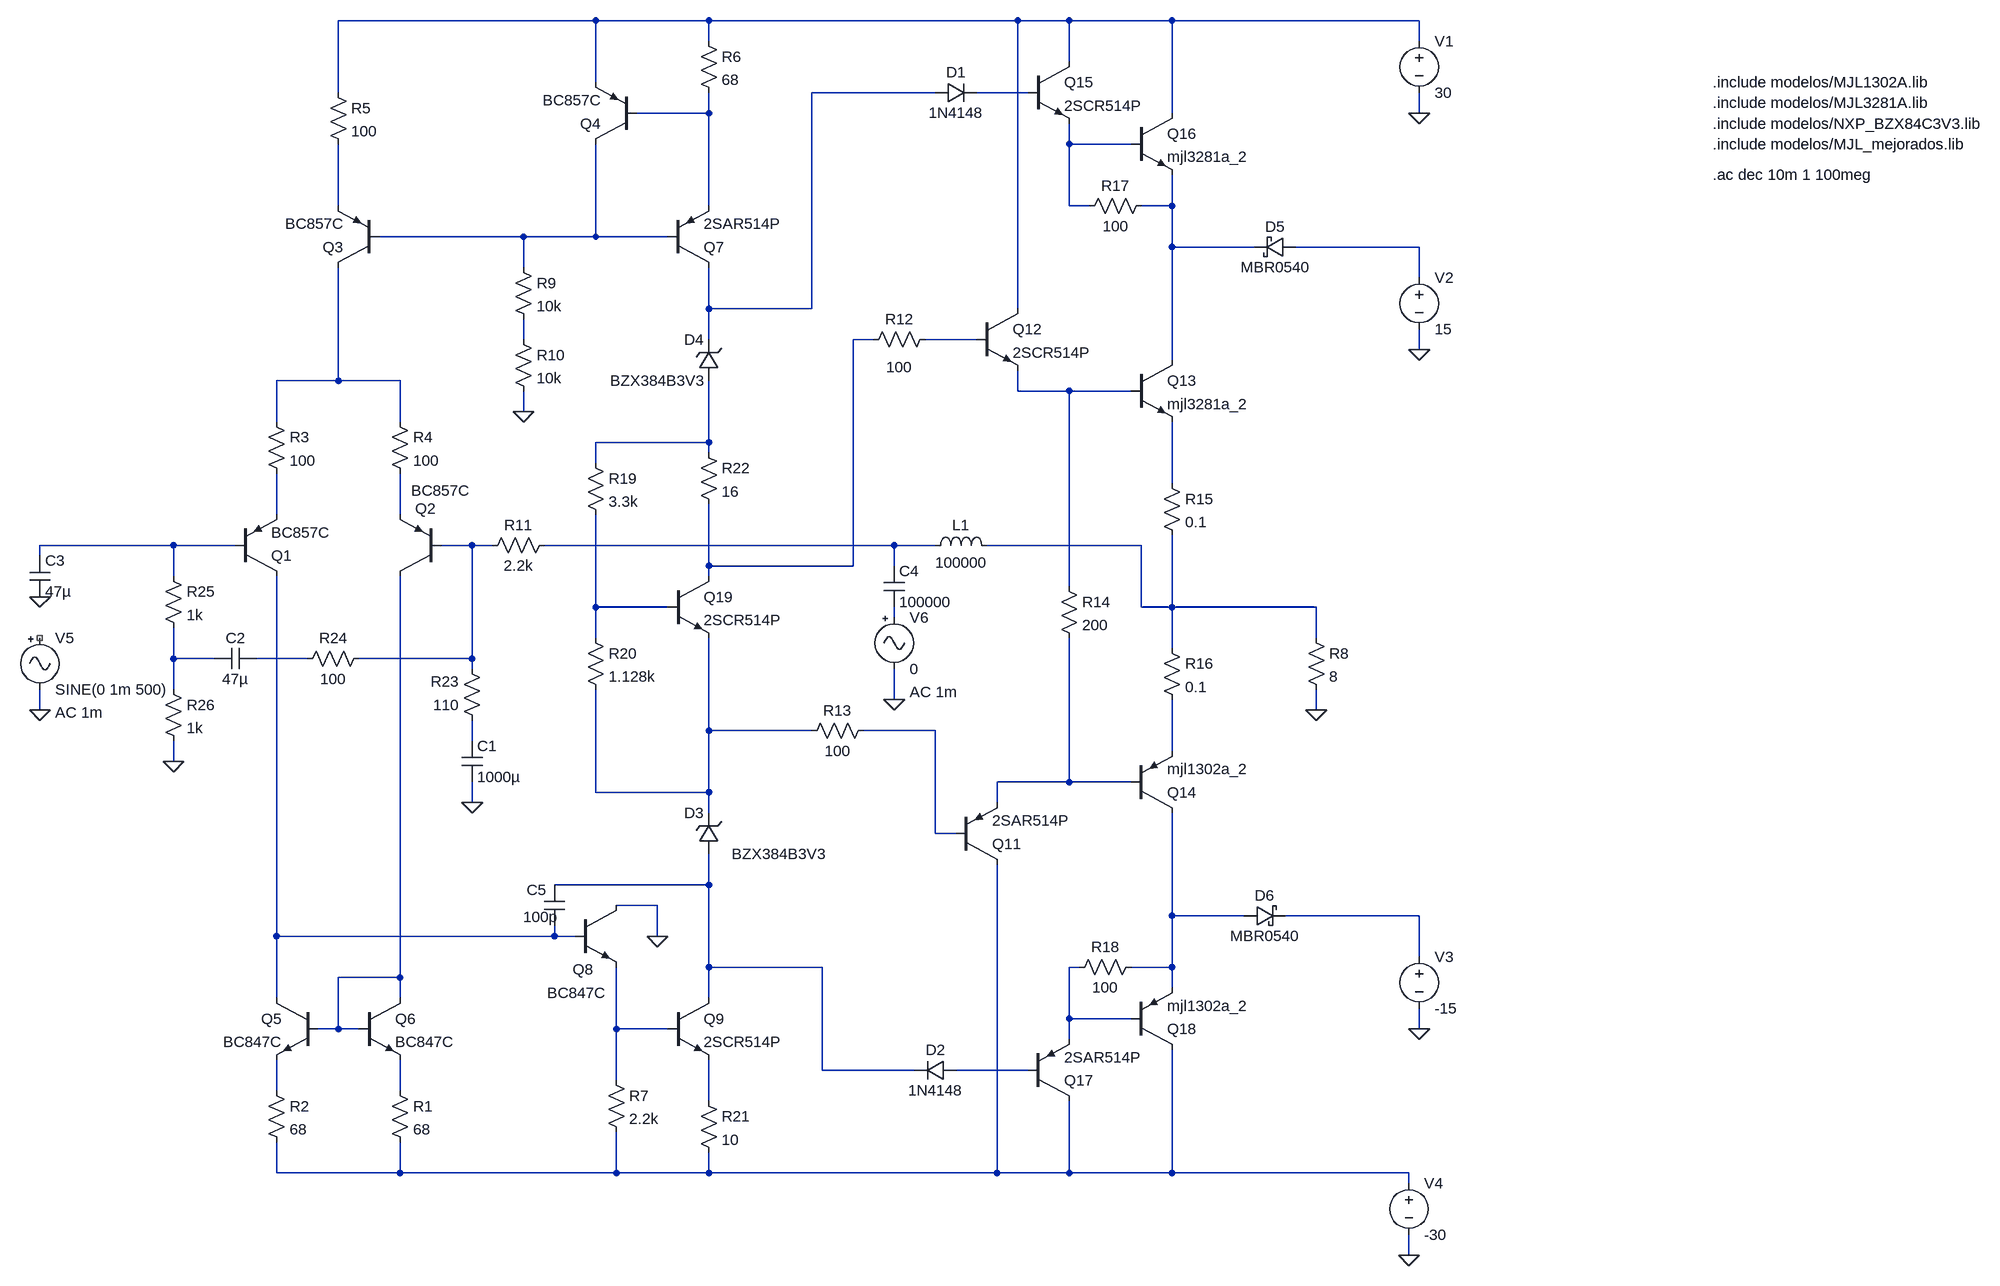
[diagram p0: schematic tp_final_amplificador_lazo_abierto.asc]
tp_final_amplificador_lazo_abierto.asc, the LTspice schematic file:
Version 4
SHEET 1 2220 1048
WIRE 48 -912 -352 -912
WIRE 224 -912 48 -912
WIRE 704 -912 224 -912
WIRE 784 -912 704 -912
WIRE 944 -912 784 -912
WIRE 1328 -912 944 -912
WIRE 224 -880 224 -912
WIRE 1328 -880 1328 -912
WIRE 784 -848 784 -912
WIRE 48 -816 48 -912
WIRE -352 -800 -352 -912
WIRE 576 -800 384 -800
WIRE 720 -800 640 -800
WIRE 224 -768 224 -800
WIRE 224 -768 112 -768
WIRE 944 -768 944 -912
WIRE 1328 -768 1328 -800
WIRE 784 -720 784 -752
WIRE 880 -720 784 -720
WIRE -352 -624 -352 -720
WIRE 224 -624 224 -768
WIRE 784 -624 784 -720
WIRE 816 -624 784 -624
WIRE 944 -624 944 -672
WIRE 944 -624 896 -624
WIRE -64 -576 -288 -576
WIRE 48 -576 48 -720
WIRE 48 -576 -64 -576
WIRE 160 -576 48 -576
WIRE 944 -560 944 -624
WIRE 1072 -560 944 -560
WIRE 1328 -560 1136 -560
WIRE -64 -528 -64 -576
WIRE 1328 -512 1328 -560
WIRE 224 -464 224 -528
WIRE 384 -464 384 -800
WIRE 384 -464 224 -464
WIRE 704 -464 704 -912
WIRE -64 -416 -64 -448
WIRE 224 -416 224 -464
WIRE 480 -416 448 -416
WIRE 640 -416 560 -416
WIRE 1328 -400 1328 -432
WIRE 944 -384 944 -560
WIRE -352 -352 -352 -528
WIRE -352 -352 -448 -352
WIRE -256 -352 -352 -352
WIRE 704 -336 704 -368
WIRE 784 -336 704 -336
WIRE 880 -336 784 -336
WIRE -64 -304 -64 -336
WIRE -448 -288 -448 -352
WIRE -256 -288 -256 -352
WIRE 224 -256 224 -352
WIRE 224 -256 48 -256
WIRE 224 -240 224 -256
WIRE 48 -224 48 -256
WIRE 944 -192 944 -288
WIRE -448 -144 -448 -208
WIRE -256 -144 -256 -208
WIRE -608 -96 -816 -96
WIRE -512 -96 -608 -96
WIRE -144 -96 -192 -96
WIRE -112 -96 -144 -96
WIRE 512 -96 -32 -96
WIRE 576 -96 512 -96
WIRE 896 -96 656 -96
WIRE -816 -80 -816 -96
WIRE 224 -64 224 -160
WIRE 448 -64 448 -416
WIRE 448 -64 224 -64
WIRE 512 -64 512 -96
WIRE -608 -48 -608 -96
WIRE 224 -48 224 -64
WIRE 784 -32 784 -336
WIRE 48 0 48 -144
WIRE 160 0 48 0
WIRE 896 0 896 -96
WIRE 944 0 944 -112
WIRE 944 0 896 0
WIRE 1168 0 944 0
WIRE 512 16 512 0
WIRE 48 48 48 0
WIRE 1168 48 1168 0
WIRE 944 64 944 0
WIRE -608 80 -608 32
WIRE -544 80 -608 80
WIRE -400 80 -480 80
WIRE -144 80 -144 -96
WIRE -144 80 -320 80
WIRE -144 96 -144 80
WIRE -608 128 -608 80
WIRE 512 144 512 96
WIRE -816 160 -816 128
WIRE 1168 160 1168 128
WIRE 224 192 224 48
WIRE 384 192 224 192
WIRE 576 192 464 192
WIRE -144 208 -144 176
WIRE 944 224 944 144
WIRE -608 240 -608 208
WIRE 784 272 784 48
WIRE 784 272 672 272
WIRE 880 272 784 272
WIRE 48 288 48 128
WIRE 224 288 224 192
WIRE 224 288 48 288
WIRE -144 304 -144 272
WIRE 672 304 672 272
WIRE 224 320 224 288
WIRE 576 352 576 192
WIRE 608 352 576 352
WIRE 224 432 224 384
WIRE 224 432 -16 432
WIRE 144 464 80 464
WIRE 944 480 944 320
WIRE 1056 480 944 480
WIRE 1328 480 1120 480
WIRE -448 512 -448 -48
WIRE -16 512 -16 496
WIRE -16 512 -448 512
WIRE 16 512 -16 512
WIRE 144 512 144 464
WIRE 1328 544 1328 480
WIRE 224 560 224 432
WIRE 400 560 224 560
WIRE 800 560 784 560
WIRE 944 560 944 480
WIRE 944 560 880 560
WIRE -256 576 -256 -48
WIRE -256 576 -352 576
WIRE 944 592 944 560
WIRE -448 608 -448 512
WIRE -256 608 -256 576
WIRE 224 608 224 560
WIRE 784 640 784 560
WIRE 880 640 784 640
WIRE -352 656 -352 576
WIRE -352 656 -384 656
WIRE -320 656 -352 656
WIRE 80 656 80 560
WIRE 160 656 80 656
WIRE 1328 656 1328 624
WIRE 784 672 784 640
WIRE 400 720 400 560
WIRE 544 720 400 720
WIRE 720 720 608 720
WIRE 80 736 80 656
WIRE -448 752 -448 704
WIRE -256 752 -256 704
WIRE 224 768 224 704
WIRE -448 880 -448 832
WIRE -256 880 -256 832
WIRE -256 880 -448 880
WIRE 80 880 80 816
WIRE 80 880 -256 880
WIRE 224 880 224 848
WIRE 224 880 80 880
WIRE 672 880 672 400
WIRE 672 880 224 880
WIRE 784 880 784 768
WIRE 784 880 672 880
WIRE 944 880 944 688
WIRE 944 880 784 880
WIRE 1312 880 944 880
WIRE 1312 896 1312 880
WIRE 1312 1008 1312 976
FLAG 144 512 0
FLAG 1168 160 0
FLAG 1312 1008 0
FLAG 1328 656 0
FLAG 1328 -400 0
FLAG 1328 -768 0
FLAG -64 -304 0
FLAG -144 304 0
FLAG -608 240 0
FLAG -816 160 0
FLAG 512 144 0
FLAG -816 -16 0
SYMBOL pnp -512 -48 M180
SYMATTR InstName Q1
SYMATTR Value BC857C
SYMBOL pnp -192 -48 R180
WINDOW 0 8 105 Left 2
WINDOW 3 -44 133 Left 2
SYMATTR InstName Q2
SYMATTR Value BC857C
SYMBOL pnp -288 -528 R180
SYMATTR InstName Q3
SYMATTR Value BC857C
SYMBOL pnp 112 -720 R180
SYMATTR InstName Q4
SYMATTR Value BC857C
SYMBOL npn -384 608 M0
SYMATTR InstName Q5
SYMATTR Value BC847C
SYMBOL npn -320 608 R0
SYMATTR InstName Q6
SYMATTR Value BC847C
SYMBOL res -272 736 R0
SYMATTR InstName R1
SYMATTR Value 68
SYMBOL res -464 736 R0
SYMATTR InstName R2
SYMATTR Value 68
SYMBOL res -464 -304 R0
SYMATTR InstName R3
SYMATTR Value 100
SYMBOL res -272 -304 R0
SYMATTR InstName R4
SYMATTR Value 100
SYMBOL res -368 -816 R0
SYMATTR InstName R5
SYMATTR Value 100
SYMBOL res 208 -896 R0
SYMATTR InstName R6
SYMATTR Value 68
SYMBOL pnp 160 -528 M180
SYMATTR InstName Q7
SYMATTR Value 2SAR514P
SYMBOL npn 16 464 R0
WINDOW 0 -4 99 Left 2
WINDOW 3 -43 136 Left 2
SYMATTR InstName Q8
SYMATTR Value BC847C
SYMBOL npn 160 608 R0
SYMATTR InstName Q9
SYMATTR Value 2SCR514P
SYMBOL res 64 720 R0
SYMATTR InstName R7
SYMATTR Value 2.2k
SYMBOL res 576 -432 R90
WINDOW 0 0 56 VBottom 2
WINDOW 3 43 56 VTop 2
SYMATTR InstName R12
SYMATTR Value 100
SYMBOL res 480 176 R90
WINDOW 0 0 56 VBottom 2
WINDOW 3 32 56 VTop 2
SYMATTR InstName R13
SYMATTR Value 100
SYMBOL npn 640 -464 R0
SYMATTR InstName Q12
SYMATTR Value 2SCR514P
SYMBOL npn 880 -384 R0
SYMATTR InstName Q13
SYMATTR Value mjl3281a_2
SYMBOL pnp 608 400 M180
SYMATTR InstName Q11
SYMATTR Value 2SAR514P
SYMBOL pnp 880 320 M180
SYMATTR InstName Q14
SYMATTR Value mjl1302a_2
SYMBOL res 768 -48 R0
SYMATTR InstName R14
SYMATTR Value 200
SYMBOL res 928 -208 R0
SYMATTR InstName R15
SYMATTR Value 0.1
SYMBOL res 928 48 R0
SYMATTR InstName R16
SYMATTR Value 0.1
SYMBOL npn 720 -848 R0
SYMATTR InstName Q15
SYMATTR Value 2SCR514P
SYMBOL npn 880 -768 R0
SYMATTR InstName Q16
SYMATTR Value mjl3281a_2
SYMBOL res 912 -640 R90
WINDOW 0 0 56 VBottom 2
WINDOW 3 32 56 VTop 2
SYMATTR InstName R17
SYMATTR Value 100
SYMBOL diode 576 -784 R270
WINDOW 0 32 32 VTop 2
WINDOW 3 0 32 VBottom 2
SYMATTR InstName D1
SYMATTR Value 1N4148
SYMBOL diode 608 704 R90
WINDOW 0 0 32 VBottom 2
WINDOW 3 32 32 VTop 2
SYMATTR InstName D2
SYMATTR Value 1N4148
SYMBOL pnp 720 768 M180
SYMATTR InstName Q17
SYMATTR Value 2SAR514P
SYMBOL pnp 880 688 M180
SYMATTR InstName Q18
SYMATTR Value mjl1302a_2
SYMBOL res 896 544 R90
WINDOW 0 0 56 VBottom 2
WINDOW 3 32 56 VTop 2
SYMATTR InstName R18
SYMATTR Value 100
SYMBOL zener 240 384 R180
WINDOW 0 24 64 Left 2
WINDOW 3 -165 0 Left 2
SYMATTR InstName D3
SYMATTR Value BZX384B3V3
SYMBOL npn 160 -48 R0
SYMATTR InstName Q19
SYMATTR Value 2SCR514P
SYMBOL res 32 -240 R0
SYMATTR InstName R19
SYMATTR Value 3.3k
SYMBOL res 32 32 R0
SYMATTR InstName R20
SYMATTR Value 1.128k
SYMBOL res 208 -256 R0
SYMATTR InstName R22
SYMATTR Value 16
SYMBOL zener 240 -352 R180
WINDOW 0 24 64 Left 2
WINDOW 3 24 0 Left 2
SYMATTR InstName D4
SYMATTR Value BZX384B3V3
SYMBOL res 1152 32 R0
SYMATTR InstName R8
SYMATTR Value 8
SYMBOL schottky 1136 -576 R90
WINDOW 0 0 32 VBottom 2
WINDOW 3 32 32 VTop 2
SYMATTR InstName D5
SYMATTR Value MBR0540
SYMATTR Description Diode
SYMATTR Type diode
SYMBOL schottky 1056 496 R270
WINDOW 0 32 32 VTop 2
WINDOW 3 0 32 VBottom 2
SYMATTR InstName D6
SYMATTR Value MBR0540
SYMATTR Description Diode
SYMATTR Type diode
SYMBOL voltage 1328 -896 R0
WINDOW 123 0 0 Left 0
WINDOW 39 0 0 Left 0
SYMATTR InstName V1
SYMATTR Value 30
SYMBOL voltage 1328 -528 R0
WINDOW 123 0 0 Left 0
WINDOW 39 0 0 Left 0
SYMATTR InstName V2
SYMATTR Value 15
SYMBOL voltage 1328 528 R0
WINDOW 123 0 0 Left 0
WINDOW 39 0 0 Left 0
SYMATTR InstName V3
SYMATTR Value -15
SYMBOL voltage 1312 880 R0
WINDOW 123 0 0 Left 0
WINDOW 39 0 0 Left 0
SYMATTR InstName V4
SYMATTR Value -30
SYMBOL res -80 -544 R0
SYMATTR InstName R9
SYMATTR Value 10k
SYMBOL res -80 -432 R0
SYMATTR InstName R10
SYMATTR Value 10k
SYMBOL res -16 -112 R90
WINDOW 0 0 56 VBottom 2
WINDOW 3 32 56 VTop 2
SYMATTR InstName R11
SYMATTR Value 2.2k
SYMBOL res -128 192 R180
WINDOW 0 36 76 Left 2
WINDOW 3 36 40 Left 2
SYMATTR InstName R23
SYMATTR Value 110
SYMBOL cap -160 208 R0
SYMATTR InstName C1
SYMATTR Value 1000µ
SYMBOL res -304 64 R90
WINDOW 0 0 56 VBottom 2
WINDOW 3 32 56 VTop 2
SYMATTR InstName R24
SYMATTR Value 100
SYMBOL cap -480 64 R90
WINDOW 0 0 32 VBottom 2
WINDOW 3 32 32 VTop 2
SYMATTR InstName C2
SYMATTR Value 47µ
SYMBOL res -624 -64 R0
SYMATTR InstName R25
SYMATTR Value 1k
SYMBOL res -624 112 R0
SYMATTR InstName R26
SYMATTR Value 1k
SYMBOL cap -832 -80 R0
SYMATTR InstName C3
SYMATTR Value 47µ
SYMBOL res 208 752 R0
SYMATTR InstName R21
SYMATTR Value 10
SYMBOL Misc\\signal -816 32 R0
WINDOW 123 24 132 Left 2
WINDOW 39 0 0 Left 0
SYMATTR Value2 AC 1m
SYMATTR InstName V5
SYMATTR Value SINE(0 1m 500)
SYMBOL ind 560 -80 R270
WINDOW 0 32 56 VTop 2
WINDOW 3 5 56 VBottom 2
SYMATTR InstName L1
SYMATTR Value 100000
SYMBOL cap 496 -64 R0
SYMATTR InstName C4
SYMATTR Value 100000
SYMBOL Misc\\signal 512 0 R0
WINDOW 123 24 132 Left 2
WINDOW 39 0 0 Left 0
SYMATTR Value2 AC 1m
SYMATTR InstName V6
SYMATTR Value 0
SYMBOL cap -32 432 R0
WINDOW 0 -27 8 Left 2
WINDOW 3 -33 50 Left 2
SYMATTR InstName C5
SYMATTR Value 100p
TEXT 1784 -816 Left 2 !.include modelos/MJL1302A.lib
TEXT 1784 -784 Left 2 !.include modelos/MJL3281A.lib
TEXT 1784 -752 Left 2 !.include modelos/NXP_BZX84C3V3.lib
TEXT 1784 -672 Left 2 !.ac dec 10m 1 100meg
TEXT 1784 -720 Left 2 !.include modelos/MJL_mejorados.lib

The netlist it stands for:
* tp_final_amplificador_lazo_abierto.asc
Q1 N035 N019 N017 0 BC857C
Q2 N037 N020 N018 0 BC857C
Q3 N013 N008 N006 0 BC857C
Q4 N008 N004 N001 0 BC857C
Q5 N035 N037 N040 0 BC847C
Q6 N037 N037 N041 0 BC847C
R1 N041 N043 68
R2 N040 N043 68
R3 N013 N017 100
R4 N013 N018 100
R5 N001 N006 100
R6 N001 N004 68
Q7 N002 N008 N004 0 2SAR514P
Q8 0 N035 N038 0 BC847C
Q9 N032 N038 N042 0 2SCR514P
R7 N038 N043 2.2k
R12 N012 N011 100
R13 N028 N027 100
Q12 N001 N012 N014 0 2SCR514P
Q13 N007 N014 N016 0 mjl3281a_2
Q11 N043 N028 N031 0 2SAR514P
Q14 N033 N031 N030 0 mjl1302a_2
R14 N014 N031 200
R15 N016 N022 0.1
R16 N022 N030 0.1
Q15 N001 N003 N005 0 2SCR514P
Q16 N001 N005 N007 0 mjl3281a_2
R17 N007 N005 100
D1 N002 N003 1N4148
D2 N039 N032 1N4148
Q17 N043 N039 N036 0 2SAR514P
Q18 N043 N036 N033 0 mjl1302a_2
R18 N033 N036 100
D3 N032 N027 BZX384B3V3
Q19 N011 N023 N027 0 2SCR514P
R19 N015 N023 3.3k
R20 N023 N027 1.128k
R22 N015 N011 16
D4 N015 N002 BZX384B3V3
R8 N022 0 8
D5 N009 N007 MBR0540
D6 N033 N034 MBR0540
V1 N001 0 30
V2 N009 0 15
V3 N034 0 -15
V4 N043 0 -30
R9 N008 N010 10k
R10 N010 0 10k
R11 N021 N020 2.2k
R23 N029 N020 110
C1 N029 0 1000µ
R24 N020 N026 100
C2 N026 N025 47µ
R25 N019 N025 1k
R26 N025 0 1k
C3 N019 0 47µ
R21 N042 N043 10
V5 NC_01 0 SINE(0 1m 500) AC 1m
L1 N021 N022 100000
C4 N021 N024 100000
V6 N024 0 0 AC 1m
C5 N032 N035 100p
.model D D
.lib standard.dio
.model NPN NPN
.model PNP PNP
.lib standard.bjt
.include modelos/MJL1302A.lib
.include modelos/MJL3281A.lib
.include modelos/NXP_BZX84C3V3.lib
.ac dec 10m 1 100meg
.include modelos/MJL_mejorados.lib
.backanno
.end